# Altium schematic sheet TDA2030音频功率放大器.SCHDOC
size A4
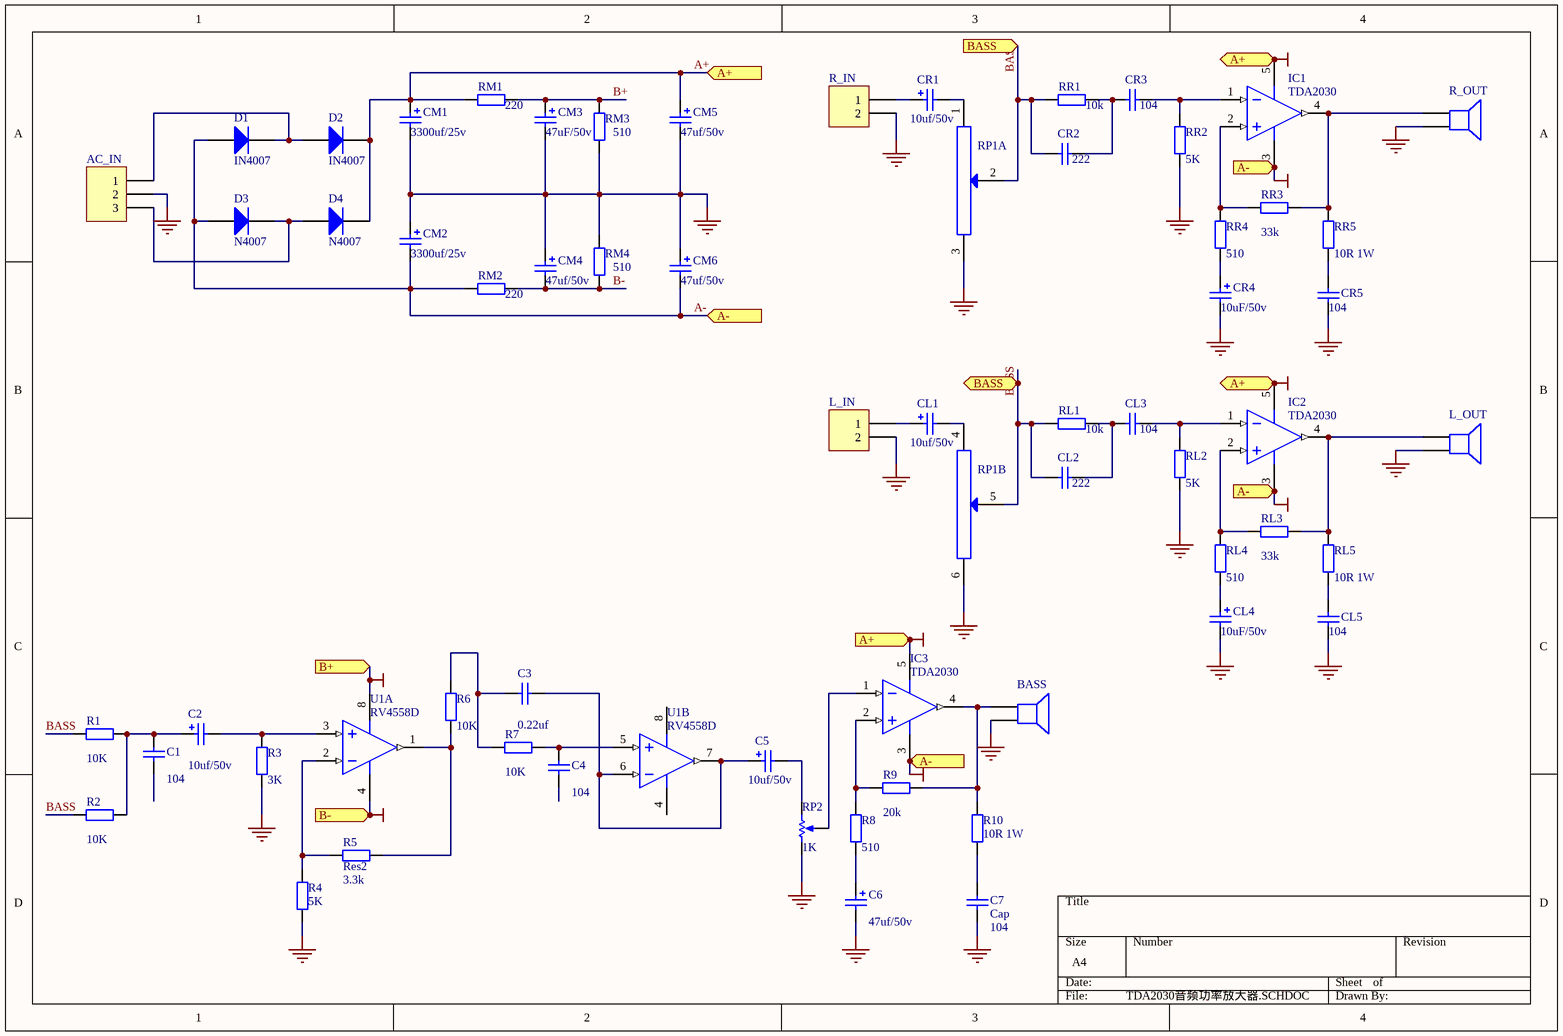
[diagram p0: TDA2030音频功率放大器.SCHDOC]

## Parts
AC_IN  Header 3  [HDR1X3]  (value not drawn)
BASS  Speaker  [PIN2]  (value not drawn)
C1  value 104  [RAD-0.3]  (hidden comment: Cap)
C2  value 10uf/50v  [POLAR0.8]  (hidden comment: Cap Pol2)
C3  value 0.22uf  [RAD-0.3]  (hidden comment: Cap)
C4  value 104  [RAD-0.3]  (hidden comment: Cap)
C5  value 10uf/50v  [POLAR0.8]  (hidden comment: Cap Pol2)
C6  value 47uf/50v  [POLAR0.8]  (hidden comment: Cap Pol2)
C7  Cap  value 104  [RAD-0.3]
CL1  value 10uf/50v  [POLAR0.8]  (hidden comment: Cap Pol2)
CL2  value 222  [RAD-0.3]  (hidden comment: Cap)
CL3  value 104  [RAD-0.3]  (hidden comment: Cap)
CL4  value 10uF/50v  [POLAR0.8]  (hidden comment: Cap Pol2)
CL5  value 104  [RAD-0.3]  (hidden comment: Cap)
CM1  value 3300uf/25v  [POLAR0.8]  (hidden comment: Cap Pol2)
CM2  value 3300uf/25v  [POLAR0.8]  (hidden comment: Cap Pol2)
CM3  value 47uF/50v  [POLAR0.8]  (hidden comment: Cap Pol2)
CM4  value 47uf/50v  [POLAR0.8]  (hidden comment: Cap Pol2)
CM5  value 47uf/50v  [POLAR0.8]  (hidden comment: Cap Pol2)
CM6  value 47uf/50v  [POLAR0.8]  (hidden comment: Cap Pol2)
CR1  value 10uf/50v  [POLAR0.8]  (hidden comment: Cap Pol2)
CR2  value 222  [RAD-0.3]  (hidden comment: Cap)
CR3  value 104  [RAD-0.3]  (hidden comment: Cap)
CR4  value 10uF/50v  [POLAR0.8]  (hidden comment: Cap Pol2)
CR5  value 104  [RAD-0.3]  (hidden comment: Cap)
D1  IN4007  [DIO10.46-5.3x2.8]
D2  IN4007  [DIO10.46-5.3x2.8]
D3  N4007  [DIO10.46-5.3x2.8]
D4  N4007  [DIO10.46-5.3x2.8]
IC1  TDA2030
IC2  TDA2030
IC3  TDA2030
L_IN  Header 2  [HDR1X2]  (value not drawn)
L_OUT  Speaker  [PIN2]  (value not drawn)
R1  value 10K  [AXIAL-0.4]  (hidden comment: Res2)
R2  value 10K  [AXIAL-0.4]  (hidden comment: Res2)
R3  value 3K  [AXIAL-0.4]  (hidden comment: Res2)
R4  value 5K  [AXIAL-0.4]  (hidden comment: Res2)
R5  Res2  value 3.3k  [AXIAL-0.4]
R6  value 10K  [AXIAL-0.4]  (hidden comment: Res2)
R7  value 10K  [AXIAL-0.4]  (hidden comment: Res2)
R8  value 510  [AXIAL-0.4]  (hidden comment: Res2)
R9  value 20k  [AXIAL-0.4]  (hidden comment: Res2)
R10  value 10R 1W  [AXIAL-0.4]  (hidden comment: Res2)
R_IN  Header 2  [HDR1X2]  (value not drawn)
R_OUT  Speaker  [PIN2]  (value not drawn)
RL1  value 10k  [AXIAL-0.4]  (hidden comment: Res2)
RL2  value 5K  [AXIAL-0.4]  (hidden comment: Res2)
RL3  value 33k  [AXIAL-0.4]  (hidden comment: Res2)
RL4  value 510  [AXIAL-0.4]  (hidden comment: Res2)
RL5  value 10R 1W  [AXIAL-0.4]  (hidden comment: Res2)
RM1  value 220  [AXIAL-0.4]  (hidden comment: Res2)
RM2  value 220  [AXIAL-0.4]  (hidden comment: Res2)
RM3  value 510  [AXIAL-0.4]  (hidden comment: Res2)
RM4  value 510  [AXIAL-0.4]  (hidden comment: Res2)
RP1  POT3  [BK09]  (value not drawn)  (parts A,B of 2)
RP2  value 1K  [VR5]  (hidden comment: POT2)
RR1  value 10k  [AXIAL-0.4]  (hidden comment: Res2)
RR2  value 5K  [AXIAL-0.4]  (hidden comment: Res2)
RR3  value 33k  [AXIAL-0.4]  (hidden comment: Res2)
RR4  value 510  [AXIAL-0.4]  (hidden comment: Res2)
RR5  value 10R 1W  [AXIAL-0.4]  (hidden comment: Res2)
U1  RV4558D  [D008]  (parts A,B of 2)

## Ports
A+, A+ (in), A- (in), B+ (in), B- (in), BASS (in)

## Nets
A+: CM1.1 CM5.1 D2.2(K) D4.2(K) IC1.5(V+) IC2.5(V+) IC3.5(V+) RM1.1 ; port A+
A-: CM2.2 CM6.2 D1.1(A) D3.1(A) IC1.3(V-) IC2.3(V-) IC3.3(V-) RM2.1 ; port A-
B+: CM3.1 RM1.2 RM3.2 U1.8(V+) ; port B+
B-: CM4.2 RM2.2 RM4.1 U1.4(V-) ; port B-
GND: AC_IN.2 BASS.2 C6.2 C7.2 CL4.2 CL5.1 CM1.2 CM2.1 CM3.2 CM4.1 CM5.2 CM6.1 CR4.2 CR5.1 L_IN.2 L_OUT.2 R3.1 R4.1 R_IN.2 R_OUT.2 RL2.1 RM3.1 RM4.2 RP1.3 RP1.6 RP2.1(TOP) RR2.1
BASS: CL2.1 CR2.1 R1.1 R2.1 RL1.1 RP1.2 RP1.5 RR1.1 ; port BASS
NetAC_IN_1: AC_IN.1 D1.2(K) D2.1(A)
NetAC_IN_3: AC_IN.3 D3.2(K) D4.1(A)
NetBASS_1: BASS.1 IC3.4(OUT) R9.2 R10.2
NetC1_2: C1.2 C2.1 R1.2 R2.2
NetC2_2: C2.2 R3.2 U1.3(IN+)
NetC3_1: C3.1 C5.1 U1.6(IN-) U1.7(OUT)
NetC3_2: C3.2 R6.1 R7.1
NetC4_1: C4.1 R7.2 U1.5(IN+)
NetC5_2: C5.2 RP2.2(BOT)
NetC6_1: C6.1 R8.1
NetC7_1: C7.1 R10.1
NetCL1_1: CL1.1 L_IN.1
NetCL1_2: CL1.2 RP1.4
NetCL2_2: CL2.2 CL3.1 RL1.2
NetCL3_2: CL3.2 IC2.1(IN-) RL2.2
NetCL4_1: CL4.1 RL4.1
NetCL5_2: CL5.2 RL5.2
NetCR1_1: CR1.1 R_IN.1
NetCR1_2: CR1.2 RP1.1
NetCR2_2: CR2.2 CR3.1 RR1.2
NetCR3_2: CR3.2 IC1.1(IN-) RR2.2
NetCR4_1: CR4.1 RR4.1
NetCR5_2: CR5.2 RR5.2
NetIC1_2: IC1.2(IN+) RR3.2 RR4.2
NetIC1_4: IC1.4(OUT) R_OUT.1 RR3.1 RR5.1
NetIC2_2: IC2.2(IN+) RL3.2 RL4.2
NetIC2_4: IC2.4(OUT) L_OUT.1 RL3.1 RL5.1
NetIC3_1: IC3.1(IN-) RP2.3(TAP)
NetIC3_2: IC3.2(IN+) R8.2 R9.1
NetR4_2: R4.2 R5.2 U1.2(IN-)
NetR5_1: R5.1 R6.2 U1.1(OUT)

Not connected (* = marked no-connect by the designer): C1 1; C4 2

## Library data of the parts
AC_IN = Header 3: Header, 3-Pin; LatestRevisionDate: 17-Jul-2002; LatestRevisionNote: Re-released for DXP Platform.; Publisher: Altium Limited
BASS L_OUT R_OUT = Speaker: Loudspeaker; Published: 24-Mar-1999; LatestRevisionDate: 17-Jul-2002; LatestRevisionNote: Re-released for DXP Platform.; Publisher: Altium Limited
C1 C3 C4 C7 CL2 CL3 CL5 CR2 CR3 CR5 = Cap: Capacitor; Published: 8-Jun-2000; LatestRevisionDate: 17-Jul-2002; LatestRevisionNote: Re-released for DXP Platform.; Publisher: Altium Limited
C2 C5 C6 CL1 CL4 CM1-CM6 CR1 CR4 = Cap Pol2: Polarized Capacitor (Axial); Published: 8-Jun-2000; LatestRevisionDate: 17-Jul-2002; LatestRevisionNote: Re-released for DXP Platform.; Publisher: Altium Limited
D1-D4 = Diode 1N4007: 1 Amp General Purpose Rectifier; Published: 8-Jun-2000; LatestRevisionDate: 17-Jul-2002; LatestRevisionNote: Re-released for DXP Platform.; DatasheetDocument: 1998; PackageDocument: Aug-1999; PackageReference: DO-41; Publisher: Altium Limited; Code_JEDEC: DO-204-AL
L_IN R_IN = Header 2: Header, 2-Pin; LatestRevisionDate: 17-Jul-2002; LatestRevisionNote: Re-released for DXP Platform.; Publisher: Altium Limited
R1-R10 RL1-RL5 RM1-RM4 RR1-RR5 = Res2: Resistor; Published: 8-Jun-2000; LatestRevisionDate: 17-Jul-2002; LatestRevisionNote: Re-released for DXP Platform.; Publisher: Altium Limited
RP2 = RPot: Potentiometer; Sim Note: Enter the Resistance value and the set point into parameter fields.; Set Position: 0.5; Published: 8-Jun-2000; LatestRevisionDate: 17-Jul-2002; LatestRevisionNote: Re-released for DXP Platform.; Publisher: Altium Limited
U1 = RV4558D: Dual High-Performance Operational Amplifier; Published: 15-Apr-2002; DatasheetDocument: Dec-1988; PackageDocument: Jan-1998; PackageReference: D008; Publisher: Altium Limited